# EAGLE schematic ESP32_LoRa PCBready (EAGLE 9.6.2)
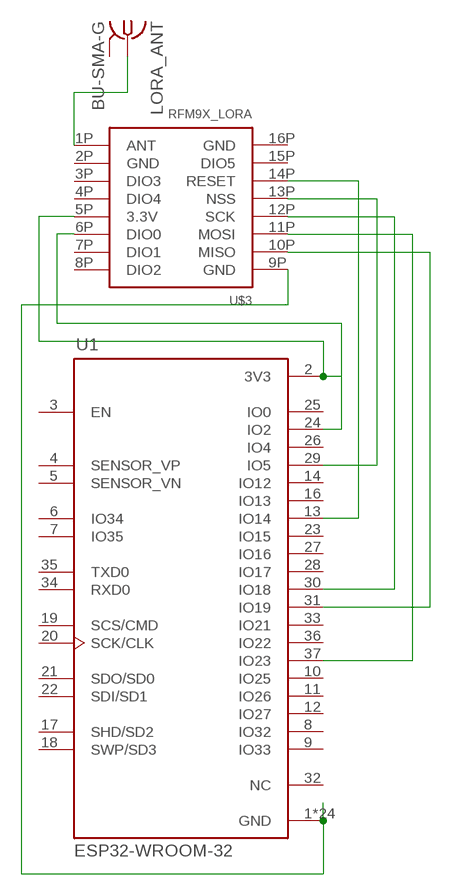
[diagram p0: schematic, sheet 1]

## Parts
LORA_ANT  BU-SMA-G  [BU-SMA-G]
U1  ESP32-WROOM-32  [MODULE_ESP32-WROOM-32]
U$3  RFM9X_LORA  [RFM9X_SMT]

## Nets
N$9: U1.2(3V3) U$3.5P(3.3V)
N$11: LORA_ANT.1 U$3.1P(ANT)
N$13: U1.1(GND) U1.15(GND) U1.38(GND) U1.39_1(GND) U1.39_2(GND) U1.39_3(GND) U1.39_4(GND) U1.39_5(GND) U1.39_6(GND) U1.39_7(GND) U1.39_8(GND) U1.39_9(GND) U1.39_10(GND) U1.39_11(GND) U1.39_12(GND) U1.39_13(GND) U1.39_14(GND) U1.39_15(GND) U1.39_16(GND) U1.39_17(GND) U1.39_18(GND) U1.39_19(GND) U1.39_20(GND) U1.39_21(GND) U$3.9P(GND)
N$14: U1.24(IO2) U$3.6P(DIO0)
N$15: U1.13(IO14) U$3.14P(RESET)
N$16: U1.29(IO5) U$3.13P(NSS)
N$17: U1.30(IO18) U$3.12P(SCK)
N$18: U1.37(IO23) U$3.11P(MOSI)
N$19: U1.31(IO19) U$3.10P(MISO)
Unconnected: LORA_ANT.2 LORA_ANT.3 LORA_ANT.4 LORA_ANT.5 U1.3(EN) U1.4(SENSOR_VP) U1.5(SENSOR_VN) U1.6(IO34) U1.7(IO35) U1.8(IO32) U1.9(IO33) U1.10(IO25) U1.11(IO26) U1.12(IO27) U1.14(IO12) U1.16(IO13) U1.17(SHD/SD2) U1.18(SWP/SD3) U1.19(SCS/CMD) U1.20(SCK/CLK) U1.21(SDO/SD0) U1.22(SDI/SD1) U1.23(IO15) U1.25(IO0) U1.26(IO4) U1.27(IO16) U1.28(IO17) U1.32(NC) U1.33(IO21) U1.34(RXD0) U1.35(TXD0) U1.36(IO22) U$3.2P(GND) U$3.3P(DIO3) U$3.4P(DIO4) U$3.7P(DIO1) U$3.8P(DIO2) U$3.15P(DIO5) U$3.16P(GND)

## Library data of the parts
LORA_ANT = con-coax:BU-SMA-G: FEMALE SMA CONNECTOR Radiall distributor RS 193-9117; OC_FARNELL: unknown; OC_NEWARK: unknown
U1 = ESP32-WROOM-32:ESP32-WROOM-32: Check availability <https://pricing.snapeda.com/parts/ESP32-WROOM-32/Espressif%20Systems/view-part?ref=eda>; AVAILABILITY: In Stock; DESCRIPTION: Bluetooth, WiFi 802.11b/g/n, Bluetooth v4.2 +EDR, Class 1, 2 and 3 Transceiver Module 2.4GHz ~ 2.5GHz Antenna Not Included, U.FL Surface Mount; MF: Espressif Systems; MP: ESP32-WROOM-32; PACKAGE: Module Espressif Systems; PRICE: None; PURCHASE-URL: https://pricing.snapeda.com/search/part/ESP32-WROOM-32/?ref=eda
U$3 = altro:RFM9X_LORA: HopeRF RFM95/96/97/98 LoRa Module